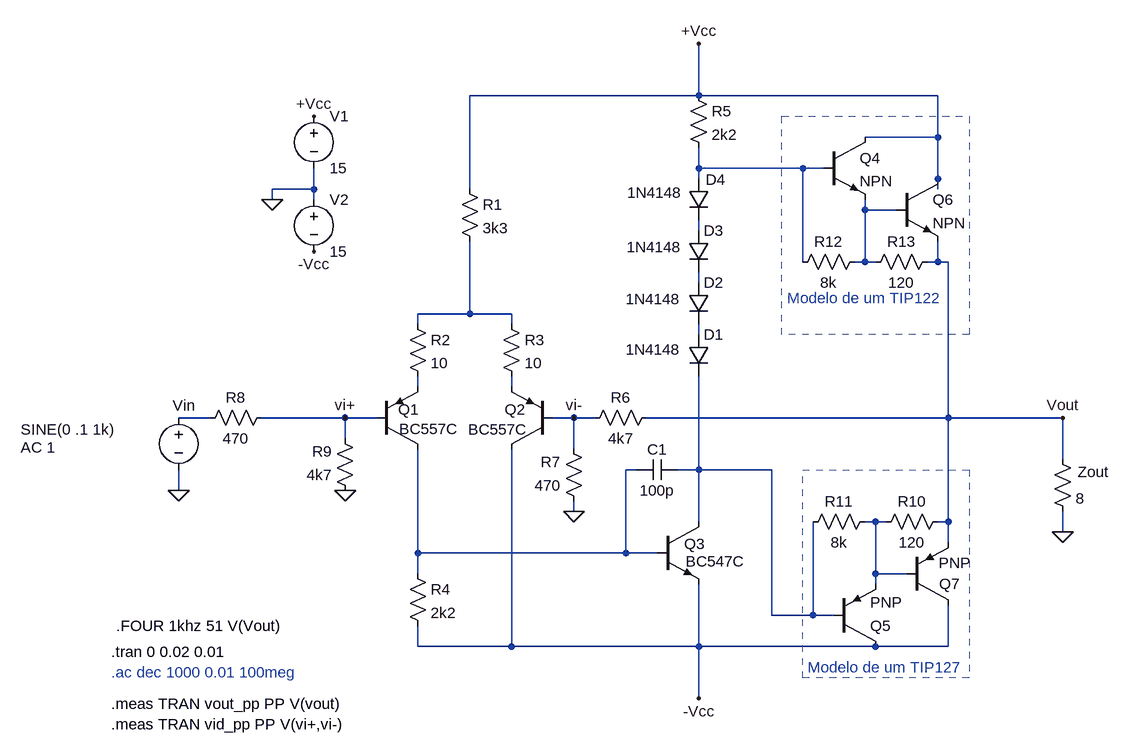
[diagram p0: schematic Amp_v0.asc]
Amp_v0.asc, the LTspice schematic file:
Version 4.1
SHEET 1 1512 688
WIRE 400 -336 400 -416
WIRE 400 -336 48 -336
WIRE 768 -336 400 -336
WIRE 768 -272 768 -336
WIRE 768 -272 656 -272
WIRE 400 -224 400 -256
WIRE 560 -224 400 -224
WIRE 592 -224 560 -224
WIRE 400 -208 400 -224
WIRE 768 -208 768 -272
WIRE -192 -192 -192 -224
WIRE -192 -192 -256 -192
WIRE 48 -192 48 -336
WIRE 768 -192 768 -208
WIRE -256 -176 -256 -192
WIRE -192 -176 -192 -192
WIRE 656 -160 656 -176
WIRE 704 -160 656 -160
WIRE 400 -128 400 -144
WIRE 560 -80 560 -224
WIRE 656 -80 656 -160
WIRE 656 -80 640 -80
WIRE 672 -80 656 -80
WIRE 768 -80 768 -112
WIRE 768 -80 752 -80
WIRE 784 -80 768 -80
WIRE 400 -48 400 -64
WIRE 48 0 48 -112
WIRE 48 0 -32 0
WIRE 112 0 48 0
WIRE -32 16 -32 0
WIRE 112 16 112 0
WIRE 400 32 400 16
WIRE -32 112 -32 96
WIRE 112 112 112 96
WIRE -352 160 -400 160
WIRE -144 160 -272 160
WIRE -96 160 -144 160
WIRE 208 160 176 160
WIRE 240 160 208 160
WIRE 784 160 784 -80
WIRE 784 160 320 160
WIRE 960 160 784 160
WIRE -144 192 -144 160
WIRE 208 208 208 160
WIRE 960 224 960 160
WIRE 304 240 288 240
WIRE 400 240 400 96
WIRE 400 240 368 240
WIRE 512 240 400 240
WIRE -400 272 -400 240
WIRE 208 304 208 288
WIRE 400 320 400 240
WIRE 672 320 656 320
WIRE 688 320 672 320
WIRE 784 320 784 160
WIRE 784 320 768 320
WIRE 960 336 960 304
WIRE 784 352 784 320
WIRE -32 368 -32 208
WIRE 288 368 288 240
WIRE 288 368 -32 368
WIRE 336 368 288 368
WIRE -32 400 -32 368
WIRE 672 400 672 320
WIRE 720 400 672 400
WIRE 672 416 672 400
WIRE 512 464 512 240
WIRE 576 464 576 320
WIRE 576 464 512 464
WIRE 608 464 576 464
WIRE -32 512 -32 480
WIRE 112 512 112 208
WIRE 112 512 -32 512
WIRE 400 512 400 416
WIRE 400 512 112 512
WIRE 672 512 400 512
WIRE 784 512 784 448
WIRE 784 512 672 512
WIRE 400 592 400 512
FLAG -400 272 0
FLAG -256 -176 0
FLAG -192 -304 +Vcc
FLAG 400 -416 +Vcc
FLAG -192 -96 -Vcc
FLAG 400 592 -Vcc
FLAG -144 272 0
FLAG 208 304 0
FLAG 960 160 Vout
FLAG 960 336 0
FLAG -144 160 vi+
FLAG 208 160 vi-
SYMBOL voltage -192 -320 R0
WINDOW 123 24 44 Left 2
WINDOW 39 0 0 Left 0
SYMATTR InstName V1
SYMATTR Value 15
SYMBOL voltage -192 -192 R0
WINDOW 123 0 0 Left 0
WINDOW 39 0 0 Left 0
SYMATTR InstName V2
SYMATTR Value 15
SYMBOL voltage -400 144 R0
WINDOW 123 -243 62 Left 2
WINDOW 39 24 152 Left 0
WINDOW 0 -9 -3 Left 2
WINDOW 3 -243 34 Left 2
SYMATTR Value2 AC 1
SYMATTR InstName Vin
SYMATTR Value SINE(0 .1 1k)
SYMBOL res 32 -208 R0
SYMATTR InstName R1
SYMATTR Value 3k3
SYMBOL res -48 0 R0
SYMATTR InstName R2
SYMATTR Value 10
SYMBOL res 96 0 R0
SYMATTR InstName R3
SYMATTR Value 10
SYMBOL res -48 384 R0
SYMATTR InstName R4
SYMATTR Value 2k2
SYMBOL res 384 -352 R0
SYMATTR InstName R5
SYMATTR Value 2k2
SYMBOL res 336 144 R90
WINDOW 0 0 56 VBottom 2
WINDOW 3 32 56 VTop 2
SYMATTR InstName R6
SYMATTR Value 4k7
SYMBOL res 224 304 R180
WINDOW 0 36 76 Left 2
WINDOW 3 36 40 Left 2
SYMATTR InstName R7
SYMATTR Value 470
SYMBOL res 784 304 R90
WINDOW 0 0 56 VBottom 2
WINDOW 3 32 56 VTop 2
SYMATTR InstName R10
SYMATTR Value 120
SYMBOL res 672 304 R90
WINDOW 0 0 56 VBottom 2
WINDOW 3 32 56 VTop 2
SYMATTR InstName R11
SYMATTR Value 8k
SYMBOL res 656 -96 R90
WINDOW 0 0 56 VBottom 2
WINDOW 3 32 56 VTop 2
SYMATTR InstName R12
SYMATTR Value 8k
SYMBOL res 768 -96 R90
WINDOW 0 0 56 VBottom 2
WINDOW 3 32 56 VTop 2
SYMATTR InstName R13
SYMATTR Value 120
SYMBOL diode 384 32 R0
WINDOW 3 -96 23 Left 2
SYMATTR Value 1N4148
SYMATTR InstName D1
SYMBOL diode 384 -48 R0
WINDOW 3 -96 25 Left 2
SYMATTR Value 1N4148
SYMATTR InstName D2
SYMBOL diode 384 -128 R0
WINDOW 3 -95 25 Left 2
SYMATTR Value 1N4148
SYMATTR InstName D3
SYMBOL diode 384 -208 R0
WINDOW 0 27 1 Left 2
WINDOW 3 -94 21 Left 2
SYMATTR InstName D4
SYMATTR Value 1N4148
SYMBOL cap 368 224 R90
WINDOW 0 0 32 VBottom 2
WINDOW 3 32 32 VTop 2
SYMATTR InstName C1
SYMATTR Value 100p
SYMBOL npn 336 320 R0
WINDOW 0 42 34 Left 2
WINDOW 3 44 61 Left 2
SYMATTR InstName Q3
SYMATTR Value BC547C
SYMBOL npn 592 -272 R0
SYMATTR InstName Q4
SYMBOL pnp 608 512 M180
SYMATTR InstName Q5
SYMBOL npn 704 -208 R0
SYMATTR InstName Q6
SYMBOL pnp 720 448 M180
WINDOW 0 50 32 Left 2
WINDOW 3 49 65 Left 2
SYMATTR InstName Q7
SYMBOL pnp -96 208 M180
WINDOW 0 34 61 Left 2
WINDOW 3 35 31 Left 2
SYMATTR InstName Q1
SYMATTR Value BC557C
SYMBOL pnp 176 208 R180
WINDOW 0 42 61 Left 2
WINDOW 3 40 30 Left 2
SYMATTR InstName Q2
SYMATTR Value BC557C
SYMBOL res -256 144 R90
WINDOW 0 0 56 VBottom 2
WINDOW 3 32 56 VTop 2
SYMATTR InstName R8
SYMATTR Value 470
SYMBOL res -128 288 R180
WINDOW 0 36 76 Left 2
WINDOW 3 36 40 Left 2
SYMATTR InstName R9
SYMATTR Value 4k7
SYMBOL res 944 208 R0
WINDOW 0 39 35 Left 2
SYMATTR InstName Zout
SYMATTR Value 8
TEXT -504 520 Left 2 !.tran 0 0.02 0.01
TEXT -496 480 Left 2 !.FOUR 1khz 51 V(Vout)
TEXT 536 -24 Left 2 ;Modelo de um TIP122
TEXT 568 544 Left 2 ;Modelo de um TIP127
TEXT -504 552 Left 2 ;.ac dec 1000 0.01 100meg
TEXT -504 600 Left 2 !.meas TRAN vout_pp PP V(vout)
TEXT -504 632 Left 2 !.meas TRAN vid_pp PP V(vi+,vi-)
RECTANGLE Normal 816 32 528 -304 2
RECTANGLE Normal 816 560 560 240 2

The netlist it stands for:
* Amp_v0.asc
V1 +Vcc 0 15
V2 0 -Vcc 15
Vin N009 0 SINE(0 .1 1k) AC 1
R1 +Vcc N005 3k3
R2 N005 N007 10
R3 N005 N008 10
R4 N010 -Vcc 2k2
R5 +Vcc N001 2k2
R6 Vout vi- 4k7
R7 0 vi- 470
R10 Vout N012 120
R11 N012 N011 8k
R12 N002 N001 8k
R13 Vout N002 120
D1 N006 N011 1N4148
D2 N004 N006 1N4148
D3 N003 N004 1N4148
D4 N001 N003 1N4148
C1 N011 N010 100p
Q3 N011 N010 -Vcc 0 BC547C
Q4 +Vcc N001 N002 0 NPN
Q5 -Vcc N011 N012 0 PNP
Q6 +Vcc N002 Vout 0 NPN
Q7 -Vcc N012 Vout 0 PNP
Q1 N010 vi+ N007 0 BC557C
Q2 -Vcc vi- N008 0 BC557C
R8 vi+ N009 470
R9 0 vi+ 4k7
R§Zout Vout 0 8
.model D D
.lib standard.dio
.model NPN NPN
.model PNP PNP
.lib standard.bjt
.tran 0 0.02 0.01
.FOUR 1khz 51 V(Vout)
* Modelo de um TIP122
* Modelo de um TIP127
* .ac dec 1000 0.01 100meg
.meas TRAN vout_pp PP V(vout)
.meas TRAN vid_pp PP V(vi+,vi-)
.backanno
.end